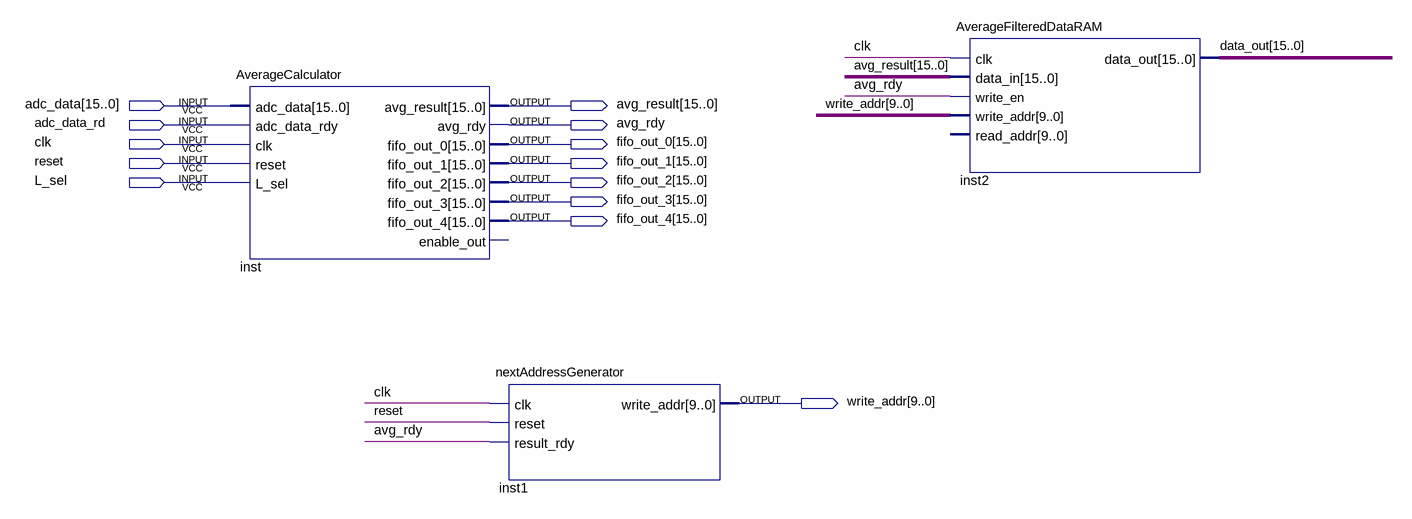
[diagram p0: schematic sheet]
// Quartus schematic testing.bdf as structural Verilog: 3 symbols, 13 pins
module testing (
  input  [15:0] adc_data,
  input  adc_data_rd,
  input  clk,
  input  reset,
  input  L_sel,
  output [15:0] avg_result,
  output avg_rdy,
  output [15:0] fifo_out_0,
  output [15:0] fifo_out_1,
  output [15:0] fifo_out_2,
  output [15:0] fifo_out_3,
  output [15:0] fifo_out_4,
  output [9:0] write_addr
);

  wire [15:0] data_out;

  AverageCalculator inst (
    .adc_data(adc_data), .adc_data_rdy(adc_data_rd), .clk(clk), .reset(reset), .L_sel(L_sel),
    .avg_result(avg_result), .avg_rdy(avg_rdy), .fifo_out_0(fifo_out_0), .fifo_out_1(fifo_out_1),
    .fifo_out_2(fifo_out_2), .fifo_out_3(fifo_out_3), .fifo_out_4(fifo_out_4));  // open: enable_out
  nextAddressGenerator inst1 (.clk(clk), .reset(reset), .result_rdy(avg_rdy), .write_addr(write_addr));
  AverageFilteredDataRAM inst2 (
    .clk(clk), .data_in(avg_result), .write_en(avg_rdy), .write_addr(write_addr), .data_out(data_out));  // open: read_addr
endmodule
